# Altium project Carrier_Board.PrjPcb
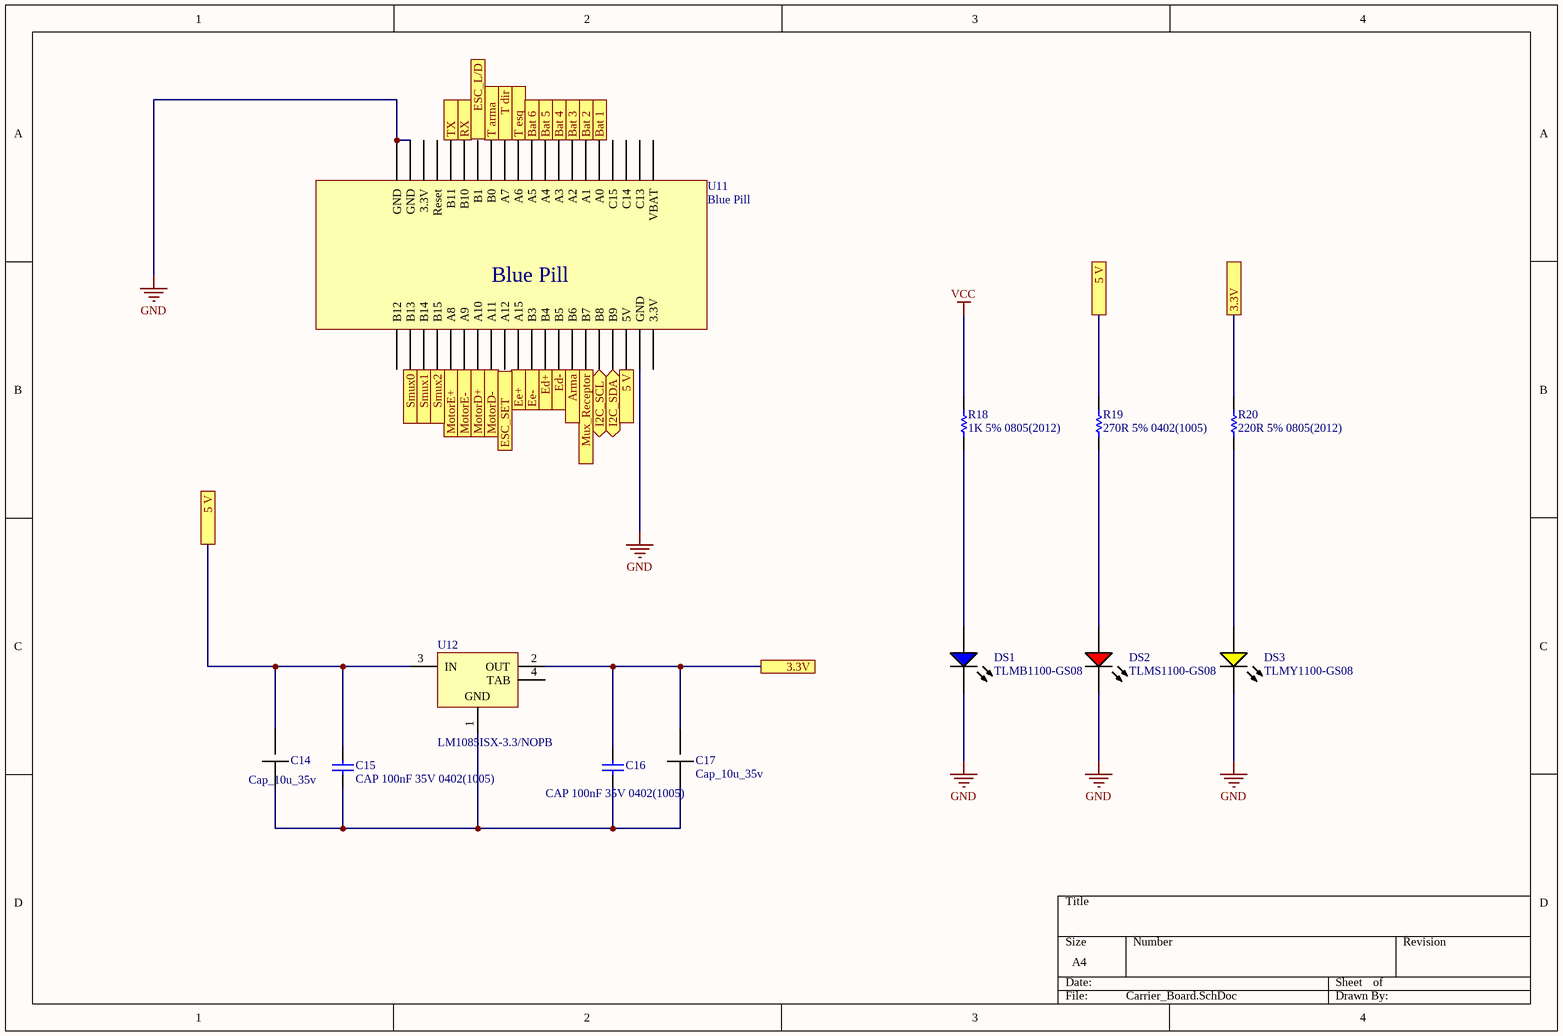
[diagram p0: Carrier_Board.SchDoc]
6 sheets, 51 parts. Net scope: flat (ports and power ports of the same name join across sheets).
Board file: Carrier_Board.PcbDoc
Sheets:
  Carrier_Board.SchDoc
  Recepitor.SchDoc
  MPU 9250.SchDoc
  Morpheus_conector.SchDoc
  Step Down.schdoc
  Medidor bateria.SchDoc

## Sheet Carrier_Board.SchDoc
size A4

### Parts
C14  Cap_10u_35v  [CAP POL 2917/7343]
C15  CAP 100nF 35V 0402(1005)  [CAPC0402(1005)60_N]
C16  CAP 100nF 35V 0402(1005)  [CAPC0402(1005)60_N]
C17  Cap_10u_35v  [CAP POL 2917/7343]
DS1  TLMB1100-GS08  [VISH-TLMX1100-2_V]
DS2  TLMS1100-GS08  [VISH-TLMX1100_V]
DS3  TLMY1100-GS08  [VISH-TLMX1100-2_V]
R18  1K 5% 0805(2012)  [RESC0805(2012)_N]
R19  270R 5% 0402(1005)  [RESC0402(1005)_N]
R20  220R 5% 0805(2012)  [RESC0805(2012)_N]
U11  Blue Pill  [blue pill]
U12  LM1085ISX-3.3/NOPB  [KTT0003B_M]

### Ports
3.3V, 5 V, Arma (out), Bat 1 (in), Bat 2 (in), Bat 3 (in), Bat 4 (in), Bat 5 (in), Bat 6 (in), Ed+ (in), Ed- (in), Ee+ (in), Ee- (in), ESC_L/D (out), ESC_SET (out), I2C_SCL (bidir), I2C_SDA (bidir), MotorD+ (out), MotorD- (out), MotorE+ (out), MotorE- (out), Mux_Receptor (in), RX, Smux0 (out), Smux1 (out), Smux2 (out), T arma (in), T dir (in), T esq (in), TX

### Nets
GND: DS1.2(K) DS2.2(K) DS3.2(K) U11.?19(GND) U11.?20(GND) U11.?39(GND)
VCC: R18.2
NetC2_2: C14.2 C15.2 R19.2 U11.?38(5V) U12.3(IN) ; port 5 V
NetC14_1: C14.1 C15.1 C16.1 C17.1 U12.1(GND)
NetC16_2: C16.2 C17.2 R20.2 U12.2(OUT) ; port 3.3V
NetDS1_1: DS1.1(A) R18.1
NetDS2_1: DS2.1(A) R19.1
NetDS3_1: DS3.1(A) R20.1
NetR21_2: U11.?6(A0) ; port Bat 1
NetR24_2: U11.?7(A1) ; port Bat 2
NetR26_2: U11.?8(A2) ; port Bat 3
NetR28_2: U11.?9(A3) ; port Bat 4
NetR30_2: U11.?10(A4) ; port Bat 5
NetR33_2: U11.?11(A5) ; port Bat 6
NetU4_4: U11.?25(A8) ; port MotorE+
NetU4_7: U11.?26(A9) ; port MotorE-
NetU5_4: U11.?27(A10) ; port MotorD+
NetU5_7: U11.?28(A11) ; port MotorD-
NetU8_10: U11.?37(B9) ; port I2C_SDA
NetU8_11: U11.?36(B8) ; port I2C_SCL
NetU10_5: U11.?35(B7) ; port Mux_Receptor
NetU10_9: U11.?22(B13) ; port Smux0
NetU10_10: U11.?23(B14) ; port Smux1
NetU10_11: U11.?24(B15) ; port Smux2
NetU11_?12: U11.?12(A6) ; port T esq
NetU11_?13: U11.?13(A7) ; port T dir
NetU11_?14: U11.?14(B0) ; port T arma
NetU11_?16: U11.?16(B10) ; port RX
NetU11_?17: U11.?17(B11) ; port TX
NetU11_?30: U11.?30(A15) ; port Ee+
NetU11_?31: U11.?31(B3) ; port Ee-
NetU11_?32: U11.?32(B4) ; port Ed+
NetU11_?33: U11.?33(B5) ; port Ed-
NetU11_?34: U11.?34(B6) ; port Arma

Not connected (* = marked no-connect by the designer): U11 ?1(VBAT) ?2(3.3V) ?3(C13) ?4(C14) ?5(C15) ?15(B1) ?18(Reset) ?21(B12) ?29(A12) ?40(3.3V); U12 4(TAB)

### Library data of the parts
C14 C17 = Cap_10u_35v: 80-T491D106M35AT7280
C15 C16 = CMP-1034-02076-1: CAP 100nF 35V ±20% 0402 (1005 Metric) Thickness 0.6mm SMD                                                 963-GMK105BJ104MV-F; Case-Metric: 1005; Tolerance: Â±20%; Case-EIA: 0402; Rated Voltage: 35 V; Max Thickness: 0.6 mm; Value: 100nF; Technology: SMT
DS1 = CMP-1666-00028-1: Blue LED, 10 mA, 3.9 V, -40 to 100 degC, 2-Pin SMD (0603), RoHS, Tape and Reel                  TLMB1100-GS08; Tolerance: 10%; Voltage Rating: 100 V; Capacitance: 10 nF; Type (Capacitors): X7R; Case\Package: Radial; ComponentLink1Description: Manufacturer URL; REACH SVHC: No SVHC; Package Quantity: 500; PackageDescription: 2-Pin Surface Mount Device, Body 1.6 x 0.8 mm; Pins: 2; ComponentLink2URL: http://download.siliconexpert.com/pdfs/2016/8/7/12/43/26/667/vsh_/manual/379263299541529tlmb1100.pdf; RoHSCompliant: true; Lead Pitch: 2.54 mm; Height: 2.54 mm; DatasheetVersion: Rev. 2.7, 03/2016; Length: 5.33 mm; ComponentLink1URL: http://www.vishay.com/; Min Operating Temperature: -55 degC; PackageReference: 0603; Packaging: Bulk; ComponentLink2Description: Datasheet; Max Operating Temperature: 125 degC; Radiation Hardening: No; Width: 3.81 mm; Mount: Through Hole
DS2 = CMP-1666-00027-1: LED, RED, 2.1 V, -40 to 100 degC, 2-Pin SMD (0603), RoHS, Tape and Reel; Type (Capacitors): C0G; Resistance: 100000000000 Ohm; Capacitance: 12 pF; Voltage Rating: 50 V; Tolerance: 5%; Min Operating Temperature: -55degC; REACH SVHC: No SVHC; ComponentLink2Description: Datasheet; ComponentLink1URL: http://www.vishay.com/; Width: 0.8 mm; Package Quantity: 4000; PackageReference: TLMX1100; ComponentLink2URL: http://www.vishay.com/docs/83173/tlmb1100.pdf; Case/Package: 0603; Case Code (Metric): 1608; Packaging: Tape and Reel; Pins: 2; ComponentLink1Description: Manufacturer URL; Max Operating Temperature: 125degC; Height: 0.8 mm; Length: 1.6 mm; Mount: Surface Mount; PackageDescription: 2-Pin Surface Mount Device, Body 1.6 x 0.8 mm; DatasheetVersion: Rev. 2.7, 03/2016; Case Code (Imperial): 0603; Voltage Rating (DC): 50 V; RoHSCompliant: True; Radiation Hardening: No
DS3 = CMP-1666-00030-1: Yellow LED, 20 mA, 2.1 V, -40 to 100 degC, 2-Pin SMD (0603), RoHS, Tape and Reel             TLMY1100-GS08; ComponentLink2Description: Datasheet; ComponentLink2URL: http://download.siliconexpert.com/pdfs/2016/8/7/12/43/26/667/vsh_/manual/379263299541529tlmb1100.pdf; ComponentLink1Description: Manufacturer URL; PackageDescription: 2-Pin Surface Mount Device, Body 1.6 x 0.8 mm; DatasheetVersion: Rev. 2.7, 03/2016; ComponentLink1URL: http://www.vishay.com/; PackageReference: 0603
R18 = CMP-1013-00074-1: 1K 0.125W 5% 0805 (2012 Metric)  SMD                                667-ERJ-P06J102V; Case-EIA: 0805; Case-Metric: 2012; Power: 0.500 W; Value: 1000.00 Ohm; Technology: SMT; Tolerance: 5 %
R19 = CMP-1011-00060-1: 270R 0.063W 5% 0402 (1005 Metric)  SMD; Case-Metric: 1005; Value: 270.00 Ohm; Case-EIA: 0402; Tolerance: 5 %; Technology: SMT; Power: 0.063 W
R20 = CMP-1013-00058-1: 220R 0.125W 5% 0805 (2012 Metric)  SMD                               603-RC0805JR-7W220RL; Power: 0.250 W; Value: 220.00 Ohm; Case-Metric: 2012; Case-EIA: 0805; Technology: SMT; Tolerance: 5 %
U12 = CMP-0062-00579-4: 3A Low Dropout Positive Regulators, 3-pin TO-263, Pb-Free; Manufacturer: Texas Instruments; High-Reliability: Y; PackageTopMarking: NSUZXYTTE#*LM1085*IS-3.3; CompType: LDO IC; PowerWise: N; PackageDescription: TO-263, Molded, .400 x .390 x .180in, 3 Lead, .1in Pitch, Surface Mount; RoHS: Y; Code_JEDEC: MO-169-AA; ComponentLink1Description: Datasheet URL; ComponentLink1URL: http://www.ti.com/general/docs/lit/getliterature.tsp?genericPartNumber=LM1085&fileType=pdf; PartNumber: LM1085ISX-3.3/NOPB; PinCount: 3; PackageReference: KTT0003B

## Sheet Recepitor.SchDoc
size A4
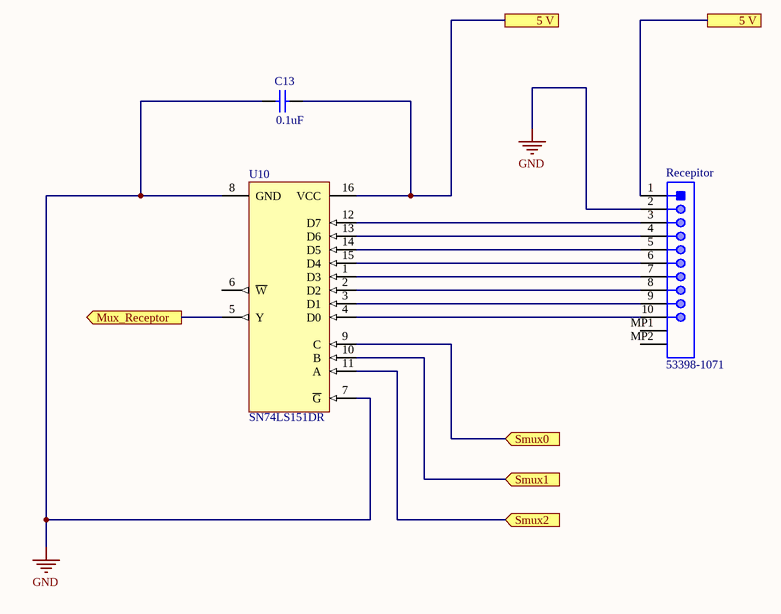
[diagram p1: Recepitor.SchDoc]

### Parts
C13  Capacitance Value: 0.1uF  [CAPC1608X90X30LL10T20]  (hidden comment: 710-885012206071)
Recepitor  53398-1071  [MOLX-53398-1071_V]
U10  SN74LS151DR  [D0016A_L]

### Ports
5 V, Mux_Receptor (out), Smux0 (in), Smux1 (in), Smux2 (in)

### Nets
GND: C13.1 Recepitor.2 U10.7(~{G}) U10.8(GND)
NetC2_2: C13.2 Recepitor.1 U10.16(VCC) ; port 5 V
NetRecepitor_3: Recepitor.3 U10.12(D7)
NetRecepitor_4: Recepitor.4 U10.13(D6)
NetRecepitor_5: Recepitor.5 U10.14(D5)
NetRecepitor_6: Recepitor.6 U10.15(D4)
NetRecepitor_7: Recepitor.7 U10.1(D3)
NetRecepitor_8: Recepitor.8 U10.2(D2)
NetRecepitor_9: Recepitor.9 U10.3(D1)
NetRecepitor_10: Recepitor.10 U10.4(D0)
NetU10_5: U10.5(Y) ; port Mux_Receptor
NetU10_9: U10.9(C) ; port Smux0
NetU10_10: U10.10(B) ; port Smux1
NetU10_11: U10.11(A) ; port Smux2

Not connected (* = marked no-connect by the designer): Recepitor MP1 MP2; U10 6(~{W})

### Library data of the parts
C13 = CMP-2000-06092-1: Chip Capacitor, 100 nF, +/- 10%, 50 V, -55 to 125 degC, 0603 (1608 Metric), RoHS, Tape and Reel               710-885012206071; Manufacturer: SamsungElectro-Mechanics; Product Length: 1.6mm; Voltage: 25Vdc; Product Height: 0.8mm; Rad Hard: No; Dielectric: X7R; Packaging: Tape&Reel; Package Description: 2-Pin Surface Mount Device, Body 1.60 x 0.80 mm; Package Reference: 0603; Datasheet Version: 06/2016; Operating Temperature: -55to125°C; Category: CapacitorCeramicMultilayer; Product Depth: 0.8mm; Mounting Technology: SurfaceMount; Package/Case: 0603; Tolerance: 10%; Construction: Flat; Mounting: SurfaceMount; Datasheet URL: https://br.mouser.com/datasheet/2/445/885012206071-554587.pdf
Recepitor = CMP-2000-05635-1: Male Header, Pitch 1.25 mm, 1 x 10 Position, Height 4.7 mm, -40 to 85 degC, RoHS, Tape and Reel; Manufacturer: Molex; Mounting Angle: Vertical; Pitch: 1.25mm; Voltage Rating: 125V; Current Rating: 1A; Number of Rows: 1Row; Housing Material: Nylon; Mounting Technology: SurfaceMount; Mounting Style: SMD; Contact Material: PhosphorBronze; Product: Headers; Datasheet URL: http://www.molex.com/pdm_docs/sd/533981071_sd.pdf; Manufacturer URL: http://www.molex.com/; Datasheet Version: Rev. J, 09/2015; Factory Pack Quantity: 1000; Brand: Molex; Packaging: Reel; Product Category: Headers&WireHousings; Contact Gender: Pin(Male); Number of Positions: 10Position; RoHS: Details; Contact Plating: Tin; Package Description: Male Header, Pitch 1.25 mm, 1 x 10 Position, Height 4.7 mm; Series: 53398; Type: Shrouded; Package Reference: 53398-1071; Tradename: PicoBlade; Termination Style: SMD
U10 = CMP-1633-00148-1: 8-Line To 1-Line Data Selectors/Multiplexers, D0016A, LARGE T&R; Manufacturer: Texas Instruments; VCC(Max)(V): 5.25; Configuration: "16","1"; Channels(#): 1; F @ Nom Voltage(Max)(Mhz): 35; Input Type: TTL; Output Drive (IOL/IOH)(Max)(mA): 8/-0.4; Voltage(Nom)(V): 5; Bits(#): 16; VCC(Min)(V): 4.75; Technology Family: LS; tpd @ Nom Voltage(Max)(ns): 38; Function: Encoder/Multiplexer; Schmitt Trigger: No; Rating: Catalog; ICC @ Nom Voltage(Max)(mA): 10; PartNumber: SN74LS151DR; Operating Temperature Range(C): 0 to 70; Type: Standard; ComponentLink3URL: http://www.ti.com/lit/ml/mpds178g/mpds178g.pdf; ComponentLink1Description: Manufacturer URL; ComponentLink2Description: Datasheet; DatasheetVersion: SDLS054; Output Type: TTL; PackageReference: D0016A; ComponentLink1URL: http://www.ti.com/; Code_JEDEC: MS-012 variation AC; ComponentLink2URL: http://www.ti.com/lit/ds/symlink/sn74ls151.pdf; ComponentLink3Description: Package Specification; Generic Part Number: SN74LS151

## Sheet MPU 9250.SchDoc
size A4
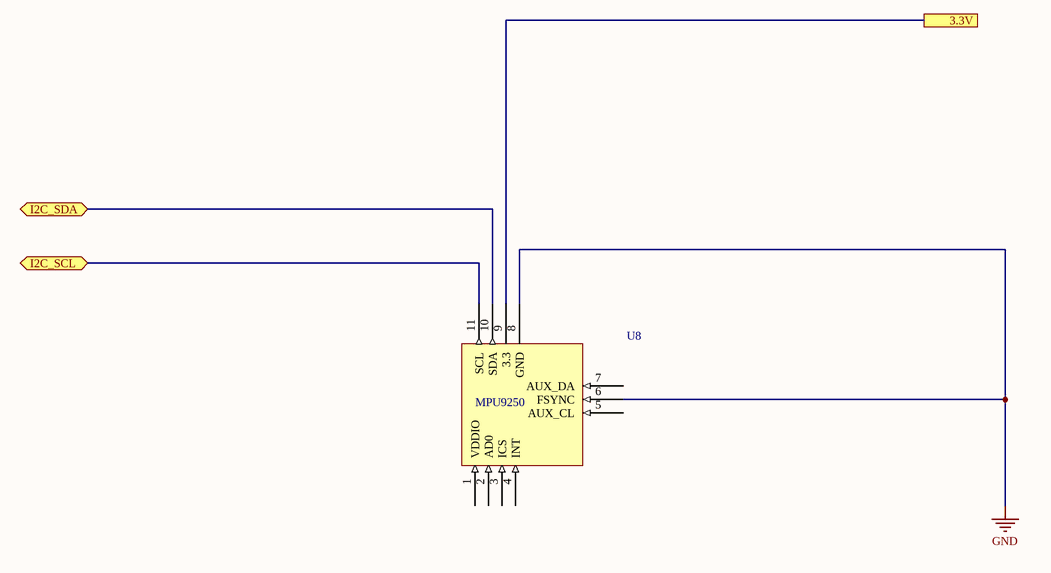
[diagram p2: MPU 9250.SchDoc]

### Parts
U8  (no value)  [MPU-9250_CONECTOR]

### Ports
3.3V, I2C_SCL (bidir), I2C_SDA (bidir)

### Nets
GND: U8.6(FSYNC) U8.8(GND)
NetC16_2: U8.9(3.3) ; port 3.3V
NetU8_10: U8.10(SDA) ; port I2C_SDA
NetU8_11: U8.11(SCL) ; port I2C_SCL

Not connected (* = marked no-connect by the designer): U8 1(VDDIO) 2(AD0) 3(ICS) 4(INT) 5(AUX_CL) 7(AUX_DA)

### Notes on the sheet
- (in symbol U8) MPU9250

### Library data of the parts
U8 = (no symbol name): SPARKFUN MPU9250 GYROSCOPE

## Sheet Morpheus_conector.SchDoc
size A4
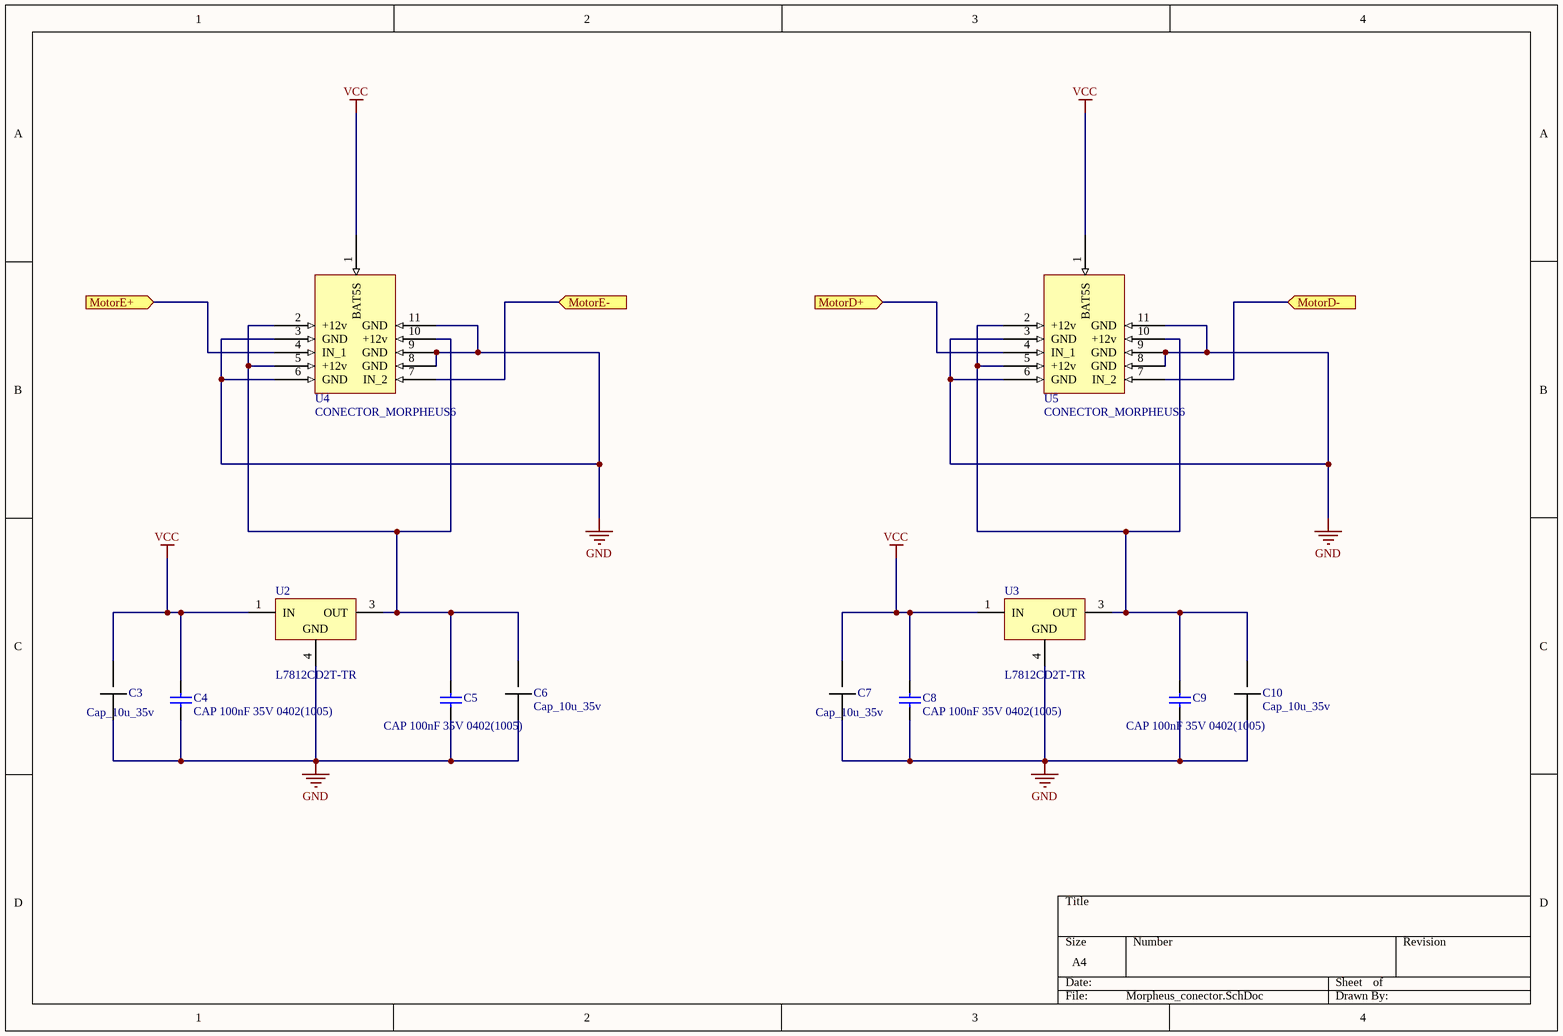
[diagram p3: Morpheus_conector.SchDoc]

### Parts
C3  Cap_10u_35v  [CAP POL 2917/7343]
C4  CAP 100nF 35V 0402(1005)  [CAPC0402(1005)60_N]
C5  CAP 100nF 35V 0402(1005)  [CAPC0402(1005)60_N]
C6  Cap_10u_35v  [CAP POL 2917/7343]
C7  Cap_10u_35v  [CAP POL 2917/7343]
C8  CAP 100nF 35V 0402(1005)  [CAPC0402(1005)60_N]
C9  CAP 100nF 35V 0402(1005)  [CAPC0402(1005)60_N]
C10  Cap_10u_35v  [CAP POL 2917/7343]
U2  L7812CD2T-TR  [TO-263_N]
U3  L7812CD2T-TR  [TO-263_N]
U4  CONECTOR_MORPHEUS6
U5  CONECTOR_MORPHEUS6

### Ports
MotorD+ (in), MotorD- (in), MotorE+ (in), MotorE- (in)

### Nets
GND: C3.1 C4.1 C5.1 C6.1 C7.1 C8.1 C9.1 C10.1 U2.4(GND) U3.4(GND) U4.3(GND) U4.6(GND) U4.8(GND) U4.9(GND) U4.11(GND) U5.3(GND) U5.6(GND) U5.8(GND) U5.9(GND) U5.11(GND)
VCC: C3.2 C4.2 C7.2 C8.2 U2.1(IN) U3.1(IN) U4.1(BAT5S) U5.1(BAT5S)
NetC5_2: C5.2 C6.2 U2.3(OUT) U4.2(+12v) U4.5(+12v) U4.10(+12v)
NetC9_2: C9.2 C10.2 U3.3(OUT) U5.2(+12v) U5.5(+12v) U5.10(+12v)
NetU4_4: U4.4(IN_1) ; port MotorE+
NetU4_7: U4.7(IN_2) ; port MotorE-
NetU5_4: U5.4(IN_1) ; port MotorD+
NetU5_7: U5.7(IN_2) ; port MotorD-

### Library data of the parts
C3 C6 C7 C10 = Cap_10u_35v: 80-T491D106M35AT7280
C4 C5 C9 = CMP-1034-02076-1: as C15 on sheet Carrier_Board; Rated Voltage: 35 V; Max Thickness: 0.6 mm; Value: 100nF; Technology: SMT
C8 = CMP-1034-02076-1: CAP 100nF 35V ±20% 0402 (1005 Metric) Thickness 0.6mm SMD                                        963-GMK105BJ104MV-F; Case-Metric: 1005; Tolerance: Â±20%; Case-EIA: 0402; Rated Voltage: 35 V; Max Thickness: 0.6 mm; Value: 100nF; Technology: SMT
U2 U3 = CMP-0244-00182-1: Positive Voltage Regulator, 3-Pin D2PAK, Tape and Reel; PackageDescription: 3-Pin Transistor Outline Package 2.54 mm Pitch, 15.4 mm Lead Span (D2PAK); ComponentLink1Description: Manufacturer URL; PackageReference: TO-263; DatasheetVersion: 16/11/2011; ComponentLink2URL: http://www.st.com/internet/com/TECHNICAL_RESOURCES/TECHNICAL_LITERATURE/DATASHEET/CD00000444.pdf; ComponentLink1URL: http://www.st.com; PackageVersion: 2011; ComponentLink2Description: Datasheet

## Sheet Step Down.schdoc
size 223 x 139 mm; SheetNumber: 1; SheetTotal: 1
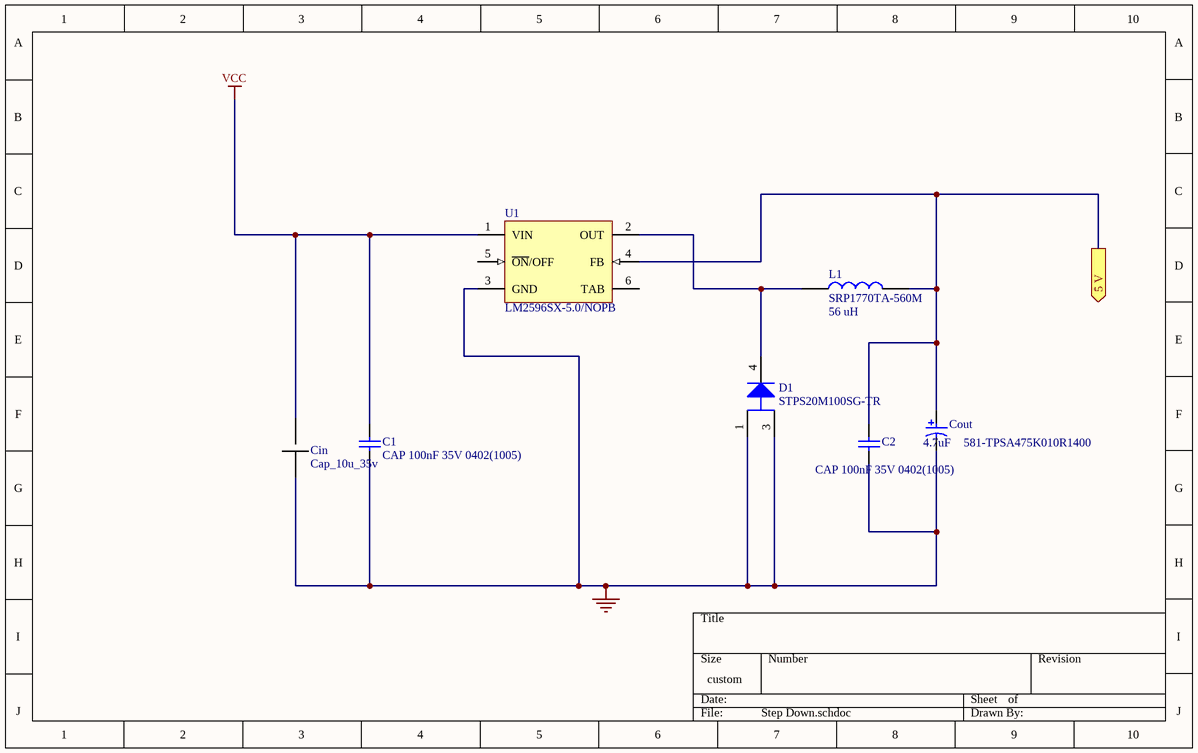
[diagram p4: Step Down.schdoc]

### Parts
C1  CAP 100nF 35V 0402(1005)  [CAPC0402(1005)60_N]
C2  CAP 100nF 35V 0402(1005)  [CAPC0402(1005)60_N]
Cin  Cap_10u_35v  [CAP POL 2917/7343]
Cout  581-TPSA475K010R1400  Capacitancia: 4.7uF  [AVX-TAJ-A-2_L]
D1  STPS20M100SG-TR  [ONSC-D2PAK-3-418B-04_J_V]
L1  SRP1770TA-560M  Indutancia: 56 uH  [INDPM173169X700N]
U1  LM2596SX-5.0/NOPB  [TS5B_M]

### Ports
5 V (out)

### Nets
0: C1.1 C2.1 Cin.1 Cout.2 D1.1(A) D1.3(A) U1.3(GND)
VCC: C1.2 Cin.2 U1.1(VIN)
NetC2_2: C2.2 Cout.1 L1.2 U1.4(FB) ; port 5 V
NetD1_4: D1.4(K) L1.1 U1.2(OUT)

Not connected (* = marked no-connect by the designer): U1 5(~{ON}/OFF) 6(TAB)

### Library data of the parts
C1 = CMP-1034-02076-1: CAP 100nF 35V ±20% 0402 (1005 Metric) Thickness 0.6mm SMD                                                  963-GMK105BJ104MV-F; Case-Metric: 1005; Tolerance: Â±20%; Case-EIA: 0402; Rated Voltage: 35 V; Max Thickness: 0.6 mm; Value: 100nF; Technology: SMT
C2 = CMP-1034-02076-1: as C15 on sheet Carrier_Board; Rated Voltage: 35 V; Max Thickness: 0.6 mm; Value: 100nF; Technology: SMT
Cin = Cap_10u_35v: 80-T491D106M35AT7280
Cout = CMP-2100-03687-1: Standard Tantalum, 4.7 uF, +/- 10%, 10 V, -55 to 125 degC, 2-Pin SMD (1206), RoHS, Tape and Reel     581-TPSA475K010R1400; Manufacturer: AVX; Dissipation Factor: 6%; Voltage Rating: 10V; Polarity: Polar; Resistance: 4Ohm; Leakage Current: 800nA; Lead Free: LeadFree; Radiation Hardening: No; Depth: 1.6mm; Package Description: 2-Pin Surface Mount Device, Body 3.2 x 1.65 mm; Package Quantity: 1; Max Operating Temperature: 125degC; Case/Package: 1206; Min Operating Temperature: -55degC; Datasheet URL: https://br.mouser.com/datasheet/2/40/tps-776850.pdf; Termination: SMD/SMT; Length: 3.2mm; Height - Seated (Max): 0.071inch; Packaging: TapeandReel; Package Reference: TPS-A-475; RoHSCompliant: True; Datasheet Version: 42401.0; Voltage Rating (DC): 10V; REACH SVHC: NoSVHC; ESR (Equivalent Series Resistance): 4Ohm; Tolerance: 10%; Case Code (Metric): 3216; Voltage: 10V; Height: 1.6mm; Number of Pins: 2; Lead Pitch: 1.1mm; Dielectric Material: Tantalum; Case Code (Imperial): 1206; Width: 1.6mm; Capacitance: 4.7uF
D1 = CMP-1055-00080-1: SWITCHMODE(TM) Power Rectifier ORing Function Diode, 3-Pin D2PAK, Tape and Reel; Manufacturer: On Semiconductor; Configuration: Single; IFSM Max (A): 150; Voltagem: 455mV; PartNumber: STPS20M100SG-TR; PackageReference: D2PAK-3-418B-04_J; DatasheetVersion: Rev. 6; ComponentLink2URL: http://www.onsemi.cn/pub_link/Collateral/MBRB2515L-D.PDF; RoHS: FALSE; ComponentLink2Description: Datasheet; PackageDescription: 3-Pin D2PAK, Body 9.145 x 9.97 mm, Pitch 2.54 mm; ComponentLink1URL: http://www.onsemi.com/; Mounting Technology: Surface Mount; ComponentLink3Description: Package Specification; Packing: Tape and Reel; PackageVersion: Rev. J, 08/2004; ComponentLink1Description: Manufacturer URL; ComponentLink3URL: http://www.onsemi.com/pub_link/Collateral/BUB323Z-D.PDF
L1 = SRP1770TA-560M: Shielded Power Inductor SMD 56uH Bourns SRP1770TA Series Shielded Wire-wound SMD Inductor with a Carbonyl Powder Core, 56 H Wire-Wound 7.8A Idc Q:20; Geometry.Height: 7mm; Manufacturer_Part_Number: SRP1770TA-560M; RS Part Number: 9054781; RS Price/Stock: http://uk.rs-online.com/web/p/products/9054781; Arrow Part Number: SRP1770TA-560M; Arrow Price/Stock: https://www.arrow.com/en/products/srp1770ta-560m/bourns; Datasheet Link: http://docs-europe.electrocomponents.com/webdocs/1465/0900766b81465c8d.pdf; Manufacturer_Name: Bourns
U1 = CMP-0069-00282-2: SIMPLE SWITCHER® Power Converter 150 KHz 3A Step-Down Voltage Regulator, 5-pin TO-263; Manufacturer: Texas Instruments; PowerWise: N; PackageTopMarking: NSUZXYTTE#*LM2596S*-5.0 P+; RevisionNote: Component URLs added; ComponentLink3URL: http://www.national.com/packaging/folders/ts5b.html; Code_JEDEC: MO-169-AB; ComponentLink1Description: LM2596 Datasheet; DatasheetVersion: May-2002; ComponentLink2Description: LM2596 Web Page; PackageReference: TS5B; PackageDescription: TO-263, Molded, .400 x .390 x .180in, 5 Lead, .067in Pitch, Surface Mount; CompType: Switcher; ComponentLink1URL: http://www.national.com/ds/LM/LM2596.pdf; ComponentLink3Description: TS5B Package Page; PinCount: 5; RoHS: N; ComponentLink2URL: http://www.national.com/pf/LM/LM2596.html

## Sheet Medidor bateria.SchDoc
size A4
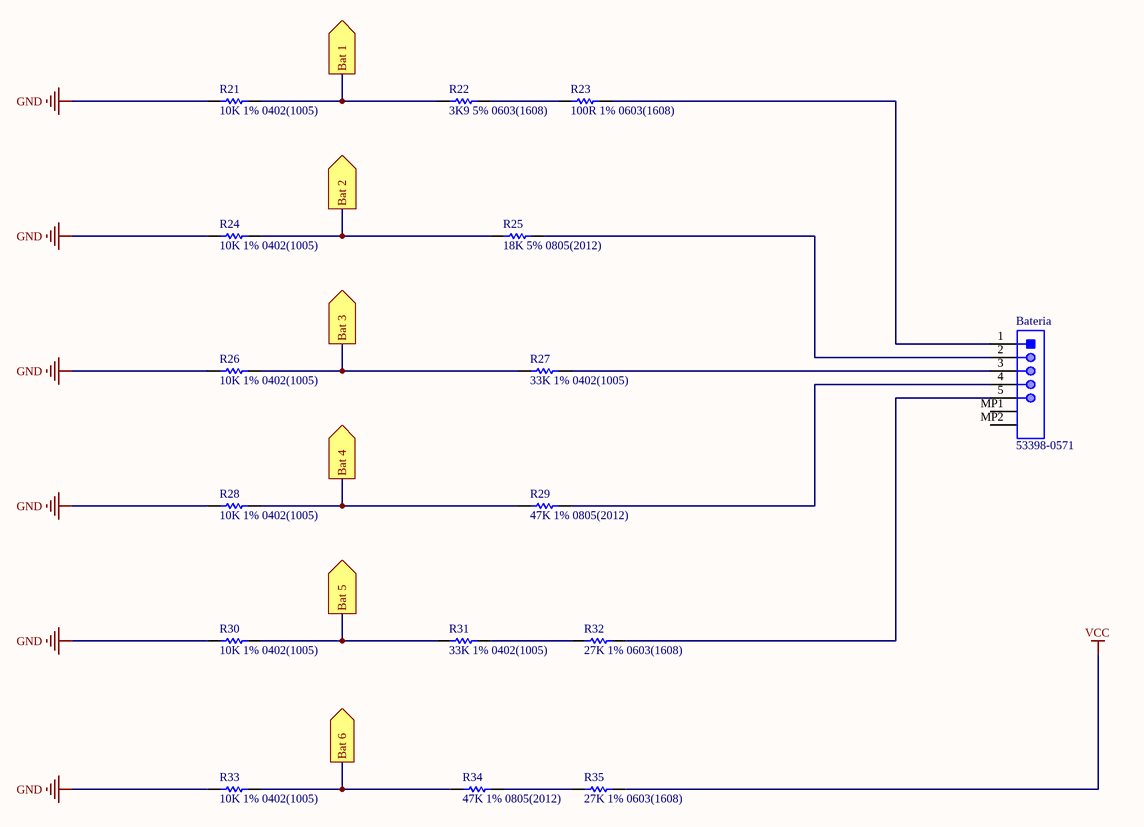
[diagram p5: Medidor bateria.SchDoc]

### Parts
Bateria  53398-0571  [MOLX-53398-0571-5_V]
R21  10K 1% 0402(1005)  [RESC0402(1005)_L]
R22  3K9 5% 0603(1608)  [RESC0603(1608)_L]
R23  100R 1% 0603(1608)  [RESC0603(1608)_L]
R24  10K 1% 0402(1005)  [RESC0402(1005)_L]
R25  18K 5% 0805(2012)  [RESC0805(2012)_N]
R26  10K 1% 0402(1005)  [RESC0402(1005)_L]
R27  33K 1% 0402(1005)  [RESC0402(1005)_L]
R28  10K 1% 0402(1005)  [RESC0402(1005)_L]
R29  47K 1% 0805(2012)  [RESC0805(2012)_N]
R30  10K 1% 0402(1005)  [RESC0402(1005)_L]
R31  33K 1% 0402(1005)  [RESC0402(1005)_L]
R32  27K 1% 0603(1608)  [RESC0603(1608)_L]
R33  10K 1% 0402(1005)  [RESC0402(1005)_L]
R34  47K 1% 0805(2012)  [RESC0805(2012)_N]
R35  27K 1% 0603(1608)  [RESC0603(1608)_L]

### Ports
Bat 1 (out), Bat 2 (out), Bat 3 (out), Bat 4 (out), Bat 5 (out), Bat 6 (out)

### Nets
GND: R21.1 R24.1 R26.1 R28.1 R30.1 R33.1
VCC: R35.2
NetBateria_1: Bateria.1 R23.2
NetBateria_2: Bateria.2 R25.2
NetBateria_3: Bateria.3 R27.2
NetBateria_4: Bateria.4 R29.2
NetBateria_5: Bateria.5 R32.2
NetR21_2: R21.2 R22.1 ; port Bat 1
NetR22_2: R22.2 R23.1
NetR24_2: R24.2 R25.1 ; port Bat 2
NetR26_2: R26.2 R27.1 ; port Bat 3
NetR28_2: R28.2 R29.1 ; port Bat 4
NetR30_2: R30.2 R31.1 ; port Bat 5
NetR31_2: R31.2 R32.1
NetR33_2: R33.2 R34.1 ; port Bat 6
NetR34_2: R34.2 R35.1

Not connected (* = marked no-connect by the designer): Bateria MP1 MP2

### Library data of the parts
Bateria = CMP-2000-05250-1: Male Header, Pitch 1.25 mm, 1 x 5 Postion, Height 4.7 mm, -40 to 85 degC, RoHS, Tape and Reel; Brand: Molex; Number of Positions: 5Position; Mounting Angle: Vertical; Current Rating: 1A; Pitch: 1.25mm; Voltage Rating: 125V; Type: Shrouded; Tradename: PicoBlade; Datasheet Version: Rev. E, 04/2006; Housing Material: Nylon; Datasheet URL: http://www.molex.com/pdm_docs/sd/533980571_sd.pdf; Termination Style: SMD; Contact Gender: Pin(Male); Factory Pack Quantity: 1000; Number of Rows: 1Row; Product: Headers; Package Reference: MOLX-53398-0571-5; Contact Material: PhosphorBronze; RoHS: Details; Manufacturer URL: http://www.molex.com/; Product Category: Headers&WireHousings; Contact Plating: Tin; Manufacturer: Molex; Series: 53398; Packaging: Reel; Mounting Style: SMD
R21 = CMP-1011-00623-1: 10K 0.063W 1% 0402 (1005 Metric)  SMD                               71-CRCW040210K0FKEDC; Case-Metric: 1005; Value: 10000.00 Ohm; Case-EIA: 0402; Tolerance: 1 %; Technology: SMT; Power: 0.063 W
R22 = CMP-1012-00088-1: 3K9 0.1W 5% 0603 (1608 Metric)  SMD                                 755-ESR03EZPJ392; Case-EIA: 0603; Power: 0.25 W; Value: 3900.00 Ohm; Case-Metric: 1608; Technology: SMT; Tolerance: 5 %
R23 = CMP-1012-00397-1: 100R 0.1W 1% 0603 (1608 Metric)  SMD                               71-CRCW0603100RFKEAC; Value: 100.00 Ohm; Case-EIA: 0603; Case-Metric: 1608; Technology: SMT; Tolerance: 1 %; Power: 0.1 W
R24 = CMP-1011-00623-1: 10K 0.063W 1% 0402 (1005 Metric)  SMD                                  71-CRCW040210K0FKEDC; Case-Metric: 1005; Value: 10000.00 Ohm; Case-EIA: 0402; Tolerance: 1 %; Technology: SMT; Power: 0.063 W
R25 = CMP-1013-00104-1: 18K 0.125W 5% 0805 (2012 Metric)  SMD                                  667-ERJ-6GEYJ183V; Value: 18000.00 Ohm; Case-EIA: 0805; Case-Metric: 2012; Technology: SMT; Power: 0.125 W; Tolerance: 5 %
R26 = CMP-1011-00623-1: 10K 0.063W 1% 0402 (1005 Metric)  SMD                                 71-CRCW040210K0FKEDC; Case-Metric: 1005; Value: 10000.00 Ohm; Case-EIA: 0402; Tolerance: 1 %; Technology: SMT; Power: 0.063 W
R27 R31 = CMP-1011-00680-1: 33K 0.063W 1% 0402 (1005 Metric)  SMD                                 755-SFR01MZPF3302; Value: 33000.00 Ohm; Case-EIA: 0402; Case-Metric: 1005; Power: 0.063 W; Tolerance: 1 %; Technology: SMT
R28 R33 = CMP-1011-00623-1: 10K 0.063W 1% 0402 (1005 Metric)  SMD                                   71-CRCW040210K0FKEDC; Case-Metric: 1005; Value: 10000.00 Ohm; Case-EIA: 0402; Tolerance: 1 %; Technology: SMT; Power: 0.063 W
R29 = CMP-1013-00699-1: 47K 0.125W 1% 0805 (2012 Metric)  SMD                                66-PCFW0805LF034702B; Case-Metric: 2012; Value: 47000.00 Ohm; Power: 0.100 W; Case-EIA: 0805; Tolerance: 1 %; Technology: SMT
R30 = CMP-1011-00623-1: 10K 0.063W 1% 0402 (1005 Metric)  SMD                                         71-CRCW040210K0FKEDC; Case-Metric: 1005; Value: 10000.00 Ohm; Case-EIA: 0402; Tolerance: 1 %; Technology: SMT; Power: 0.063 W
R32 = CMP-1012-00670-1: 27K 0.1W 1% 0603 (1608 Metric)  SMD                                      755-ESR03EZPF2702; Case-EIA: 0603; Case-Metric: 1608; Power: 0.250 W; Value: 27000.00 Ohm; Technology: SMT; Tolerance: 1 %
R34 = CMP-1013-00699-1: 47K 0.125W 1% 0805 (2012 Metric)  SMD                               66-PCFW0805LF034702B; Case-Metric: 2012; Value: 47000.00 Ohm; Power: 0.100 W; Case-EIA: 0805; Tolerance: 1 %; Technology: SMT
R35 = CMP-1012-00670-1: 27K 0.1W 1% 0603 (1608 Metric)  SMD                                          755-ESR03EZPF2702; Case-EIA: 0603; Case-Metric: 1608; Power: 0.250 W; Value: 27000.00 Ohm; Technology: SMT; Tolerance: 1 %

## Nets that join several sheets
GND: Carrier_Board (6 pins), Recepitor (C13.1 Recepitor.2 U10.7 U10.8), MPU 9250 (U8.6 U8.8), Morpheus_conector (20 pins), Medidor bateria (6 pins)
VCC: Carrier_Board (R18.2), Morpheus_conector (8 pins), Step Down (C1.2 Cin.2 U1.1), Medidor bateria (R35.2)
NetC2_2: Carrier_Board (5 pins), Recepitor (C13.2 Recepitor.1 U10.16), Step Down (C2.2 Cout.1 L1.2 U1.4)
NetC16_2: Carrier_Board (C16.2 C17.2 R20.2 U12.2), MPU 9250 (U8.9)
NetR21_2: Carrier_Board (U11.?6), Medidor bateria (R21.2 R22.1)
NetR24_2: Carrier_Board (U11.?7), Medidor bateria (R24.2 R25.1)
NetR26_2: Carrier_Board (U11.?8), Medidor bateria (R26.2 R27.1)
NetR28_2: Carrier_Board (U11.?9), Medidor bateria (R28.2 R29.1)
NetR30_2: Carrier_Board (U11.?10), Medidor bateria (R30.2 R31.1)
NetR33_2: Carrier_Board (U11.?11), Medidor bateria (R33.2 R34.1)
NetU4_4: Carrier_Board (U11.?25), Morpheus_conector (U4.4)
NetU4_7: Carrier_Board (U11.?26), Morpheus_conector (U4.7)
NetU5_4: Carrier_Board (U11.?27), Morpheus_conector (U5.4)
NetU5_7: Carrier_Board (U11.?28), Morpheus_conector (U5.7)
NetU8_10: Carrier_Board (U11.?37), MPU 9250 (U8.10)
NetU8_11: Carrier_Board (U11.?36), MPU 9250 (U8.11)
NetU10_5: Carrier_Board (U11.?35), Recepitor (U10.5)
NetU10_9: Carrier_Board (U11.?22), Recepitor (U10.9)
NetU10_10: Carrier_Board (U11.?23), Recepitor (U10.10)
NetU10_11: Carrier_Board (U11.?24), Recepitor (U10.11)